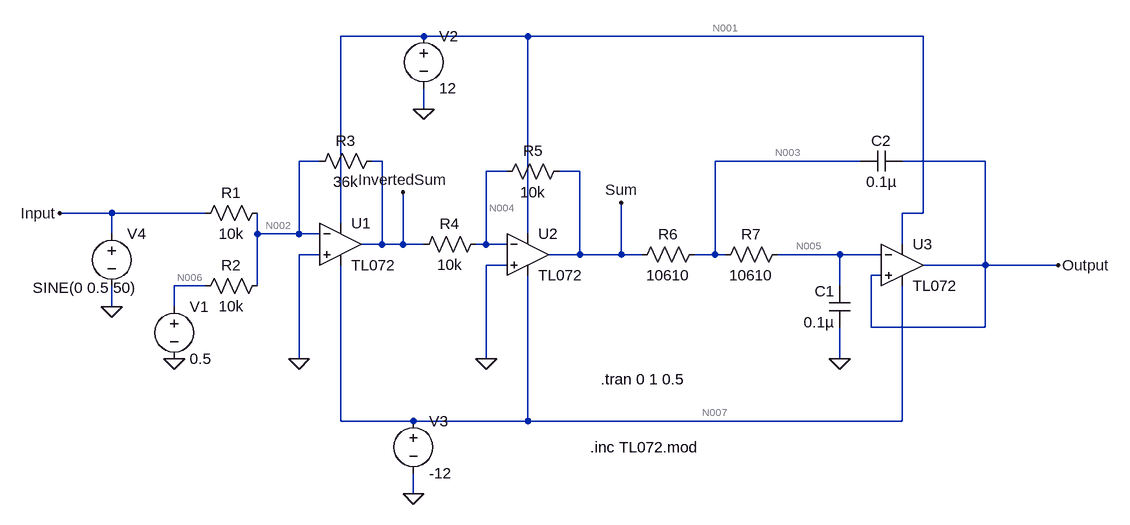
[diagram p0: schematic ELEC3400 Prac1.asc]
ELEC3400 Prac1.asc, the LTspice schematic file:
Version 4
SHEET 1 1428 680
WIRE 352 -176 224 -176
WIRE 512 -176 352 -176
WIRE 1120 -176 512 -176
WIRE 352 -64 352 -96
WIRE 192 16 160 16
WIRE 288 16 272 16
WIRE 1024 16 800 16
WIRE 1216 16 1088 16
WIRE 480 32 448 32
WIRE 592 32 560 32
WIRE -128 96 -208 96
WIRE 16 96 -128 96
WIRE 1120 96 1120 -176
WIRE 1120 96 1088 96
WIRE 224 112 224 -176
WIRE -128 128 -128 96
WIRE 96 128 96 96
WIRE 160 128 160 16
WIRE 160 128 96 128
WIRE 192 128 160 128
WIRE 512 128 512 -176
WIRE 288 144 288 16
WIRE 288 144 256 144
WIRE 320 144 320 64
WIRE 320 144 288 144
WIRE 352 144 320 144
WIRE 448 144 448 32
WIRE 448 144 432 144
WIRE 480 144 448 144
WIRE 1088 144 1088 96
WIRE 192 160 160 160
WIRE 592 160 592 32
WIRE 592 160 544 160
WIRE 656 160 656 80
WIRE 656 160 592 160
WIRE 688 160 656 160
WIRE 800 160 800 16
WIRE 800 160 768 160
WIRE 816 160 800 160
WIRE 992 160 896 160
WIRE 1056 160 992 160
WIRE 480 176 448 176
WIRE 1216 176 1216 16
WIRE 1216 176 1120 176
WIRE 1328 176 1216 176
WIRE 1056 192 1040 192
WIRE 16 208 -32 208
WIRE 96 208 96 128
WIRE 992 208 992 160
WIRE -128 240 -128 208
WIRE -32 240 -32 208
WIRE 1040 272 1040 192
WIRE 1216 272 1216 176
WIRE 1216 272 1040 272
WIRE 160 320 160 160
WIRE 448 320 448 176
WIRE 992 320 992 272
WIRE 224 416 224 176
WIRE 336 416 224 416
WIRE 512 416 512 192
WIRE 512 416 336 416
WIRE 1088 416 1088 208
WIRE 1088 416 512 416
WIRE 336 528 336 496
FLAG 160 320 0
FLAG 448 320 0
FLAG 992 320 0
FLAG 1328 176 Output
FLAG 352 -64 0
FLAG 336 528 0
FLAG -128 240 0
FLAG -208 96 Input
FLAG 320 64 InvertedSum
FLAG 656 80 Sum
FLAG -32 320 0
SYMBOL res 112 80 R90
WINDOW 0 0 56 VBottom 2
WINDOW 3 32 56 VTop 2
SYMATTR InstName R1
SYMATTR Value 10k
SYMBOL res 112 192 R90
WINDOW 0 0 56 VBottom 2
WINDOW 3 32 56 VTop 2
SYMATTR InstName R2
SYMATTR Value 10k
SYMBOL res 288 0 R90
WINDOW 0 0 56 VBottom 2
WINDOW 3 32 56 VTop 2
SYMATTR InstName R3
SYMATTR Value 36k
SYMBOL Opamps\\opamp2 224 80 R0
SYMATTR InstName U1
SYMATTR Value TL072
SYMBOL Opamps\\opamp2 512 96 R0
SYMATTR InstName U2
SYMATTR Value TL072
SYMBOL res 448 128 R90
WINDOW 0 0 56 VBottom 2
WINDOW 3 32 56 VTop 2
SYMATTR InstName R4
SYMATTR Value 10k
SYMBOL res 576 16 R90
WINDOW 0 0 56 VBottom 2
WINDOW 3 32 56 VTop 2
SYMATTR InstName R5
SYMATTR Value 10k
SYMBOL res 784 144 R90
WINDOW 0 0 56 VBottom 2
WINDOW 3 32 56 VTop 2
SYMATTR InstName R6
SYMATTR Value 10610
SYMBOL res 912 144 R90
WINDOW 0 0 56 VBottom 2
WINDOW 3 32 56 VTop 2
SYMATTR InstName R7
SYMATTR Value 10610
SYMBOL cap 1008 272 R180
WINDOW 0 24 56 Left 2
WINDOW 3 24 8 Left 2
SYMATTR InstName C1
SYMATTR Value 0.1µ
SYMBOL cap 1024 32 R270
WINDOW 0 32 32 VTop 2
WINDOW 3 0 32 VBottom 2
SYMATTR InstName C2
SYMATTR Value 0.1µ
SYMBOL Opamps\\opamp2 1088 112 R0
SYMATTR InstName U3
SYMATTR Value TL072
SYMBOL voltage -32 224 R0
WINDOW 123 0 0 Left 0
WINDOW 39 0 0 Left 0
SYMATTR InstName V1
SYMATTR Value 0.5
SYMBOL voltage 352 -192 R0
WINDOW 123 0 0 Left 0
WINDOW 39 0 0 Left 0
SYMATTR InstName V2
SYMATTR Value 12
SYMBOL voltage 336 400 R0
WINDOW 123 0 0 Left 0
WINDOW 39 0 0 Left 0
SYMATTR InstName V3
SYMATTR Value -12
SYMBOL voltage -128 112 R0
WINDOW 123 0 0 Left 0
WINDOW 39 0 0 Left 0
WINDOW 3 -122 99 Left 2
SYMATTR InstName V4
SYMATTR Value SINE(0 0.5 50)
TEXT 624 352 Left 2 !.tran 0 1 0.5
TEXT 608 456 Left 2 !.inc TL072.mod

The netlist it stands for:
* ELEC3400 Prac1.asc
R1 N002 Input 10k
R2 N002 N006 10k
R3 InvertedSum N002 36k
XU1 0 N002 N001 N007 InvertedSum TL072  ; pins In+ In- V+ V- OUT
XU2 0 N004 N001 N007 Sum TL072  ; pins In+ In- V+ V- OUT
R4 N004 InvertedSum 10k
R5 Sum N004 10k
R6 N003 Sum 10610
R7 N005 N003 10610
C1 0 N005 0.1µ
C2 N003 Output 0.1µ
XU3 Output N005 N001 N007 Output TL072  ; pins In+ In- V+ V- OUT
V1 N006 0 0.5
V2 N001 0 12
V3 N007 0 -12
V4 Input 0 SINE(0 0.5 50)
.tran 0 1 0.5
.inc TL072.mod
.backanno
.end

* Results of the author's LTspice run, read from the files saved beside the schematic
* Operating Point, zero values left out:
*   V(n002) = 19.12 µV
*   V(n006) = 500 mV
*   V(invertedsum) = -1.8 V
*   V(n007) = -12 V
*   V(n001) = 12 V
*   V(sum) = 1.8 V
*   V(n004) = 2.89 µV
*   V(n003) = 1.8 V
*   V(n005) = 1.8 V
*   V(output) = 10.48 V
*   I(R7) = -43.25 pA
*   I(R6) = -43.25 pA
*   I(R5) = 180 µA
*   I(R4) = 180 µA
*   I(R3) = -50 µA
*   I(R2) = -50 µA
*   I(R1) = 1.912 nA
*   I(V4) = 1.912 nA
*   I(V3) = 34.18 mA
*   I(V2) = -34 mA
*   I(V1) = -50 µA
*   Ix(u1:1) = 42.05 pA
*   Ix(u1:2) = 42.05 pA
*   Ix(u1:3) = 11.39 mA
*   Ix(u1:4) = -11.39 mA
*   Ix(u1:5) = 230 µA
*   Ix(u2:1) = 42.05 pA
*   Ix(u2:2) = 42.05 pA
*   Ix(u2:3) = 11.39 mA
*   Ix(u2:4) = -11.39 mA
*   Ix(u2:5) = -180 µA
*   Ix(u3:1) = 61.31 pA
*   Ix(u3:2) = 43.23 pA
*   Ix(u3:3) = 11.21 mA
*   Ix(u3:4) = -11.39 mA
*   Ix(u3:5) = 1.047 µA
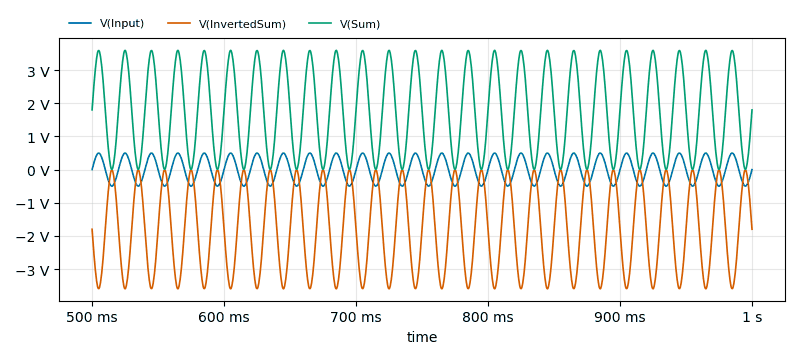
[diagram p1: Transient Analysis of ELEC3400 Prac1.asc, plotted from the saved traces]
* Transient Analysis, 1 run:
*   V(Input): min -498.1 mV, max 498.5 mV, average 44.21 µV, rms 349.7 mV, last 0 V
*   V(InvertedSum): min -3.594 V, max -6.927 mV, average -1.8 V, rms 2.196 V, last -1.8 V
*   V(Sum): min 6.951 mV, max 3.594 V, average 1.8 V, rms 2.196 V, last 1.8 V